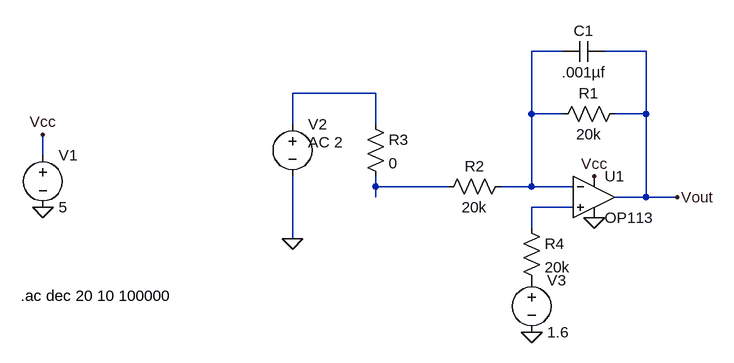
[diagram p0: schematic Current2.asc]
Current2.asc, the LTspice schematic file:
Version 4
SHEET 1 880 680
WIRE 416 -16 368 -16
WIRE 544 -16 480 -16
WIRE 128 48 0 48
WIRE 368 80 368 -16
WIRE 416 80 368 80
WIRE 544 80 544 -16
WIRE 544 80 496 80
WIRE 0 96 0 48
WIRE 128 96 128 48
WIRE -384 144 -384 112
WIRE 128 192 128 176
WIRE 240 192 128 192
WIRE 368 192 368 80
WIRE 368 192 320 192
WIRE 432 192 368 192
WIRE 128 208 128 192
WIRE 544 208 544 80
WIRE 544 208 496 208
WIRE 592 208 544 208
WIRE 432 224 368 224
WIRE 368 256 368 224
WIRE 0 272 0 176
FLAG 464 240 0
FLAG -384 224 0
FLAG -384 112 Vcc
FLAG 464 176 Vcc
FLAG 592 208 Vout
FLAG 0 272 0
FLAG 368 416 0
SYMBOL Opamps\\OP113 464 144 R0
SYMATTR InstName U1
SYMBOL voltage -384 128 R0
WINDOW 123 0 0 Left 0
WINDOW 39 24 124 Left 2
SYMATTR InstName V1
SYMATTR Value 5
SYMBOL res 512 64 R90
WINDOW 0 0 56 VBottom 2
WINDOW 3 32 56 VTop 2
SYMATTR InstName R1
SYMATTR Value 20k
SYMBOL voltage 0 80 R0
WINDOW 3 -304 -3 Left 2
WINDOW 123 24 44 Left 2
WINDOW 39 0 0 Left 0
SYMATTR InstName V2
SYMATTR Value ""
SYMATTR Value2 AC 2
SYMBOL res 112 80 R0
SYMATTR InstName R3
SYMATTR Value 0
SYMBOL cap 480 -32 R90
WINDOW 0 0 32 VBottom 2
WINDOW 3 32 32 VTop 2
SYMATTR InstName C1
SYMATTR Value .001µf
SYMBOL res 336 176 R90
WINDOW 0 0 56 VBottom 2
WINDOW 3 32 56 VTop 2
SYMATTR InstName R2
SYMATTR Value 20k
SYMBOL res 352 240 R0
SYMATTR InstName R4
SYMATTR Value 20k
SYMBOL voltage 368 320 R0
WINDOW 123 0 0 Left 0
WINDOW 39 0 0 Left 0
SYMATTR InstName V3
SYMATTR Value 1.6
TEXT -418 360 Left 2 !.ac dec 20 10 100000

The netlist it stands for:
* Current2.asc
XU1 N004 N001 Vcc 0 Vout OP113  ; pins In+ In- V+ V- OUT
V1 Vcc 0 5
R1 Vout N001 20k
V2 N002 0 AC 2
R3 N002 N003 0
C1 Vout N001 .001µf
R2 N001 N003 20k
R4 N004 P001 20k
V3 P001 0 1.6
.ac dec 20 10 100000
.lib ADI.lib
.backanno
.end